# Altium schematic sheet programming_header.SchDoc: Triumvi - Programming
size Letter; Author: Ye-Sheng Kuo; Revision: 11; SheetNumber: 10; SheetTotal: 10
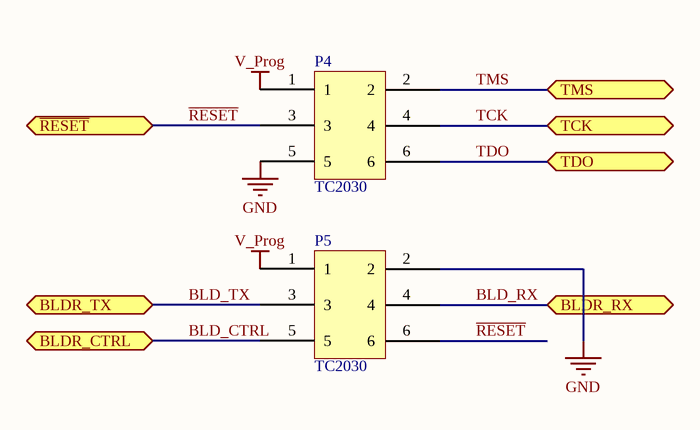
[diagram p0: programming_header.SchDoc]

## Parts
P4  TC2030  [TC2030-IDC-NLFP]
P5  TC2030  [TC2030-IDC-NLFP]

## Ports
BLDR_CTRL, BLDR_RX, BLDR_TX, TCK, TDO, TMS, ~{RESET}

## Nets
GND: P4.5 P5.2
V_Prog: P4.1 P5.1
BLD_CTRL: P5.5 ; port BLDR_CTRL
BLD_RX: P5.4 ; port BLDR_RX
BLD_TX: P5.3 ; port BLDR_TX
~{RESET}: P4.3 P5.6 ; port ~{RESET}
TCK: P4.4 ; port TCK
TDO: P4.6 ; port TDO
TMS: P4.2 ; port TMS

## Notes on the sheet
- Title
- Date:
- Author:
- Revision:
- Sheet
- of
- University of Michigan
- File:

## Library data of the parts
P4 P5 = TC2030: TC2030-MCP-NL; Note: Not a part